# Altium schematic sheet STM32G4.SchDoc
size B; SheetNumber: 2; SheetTotal: 5
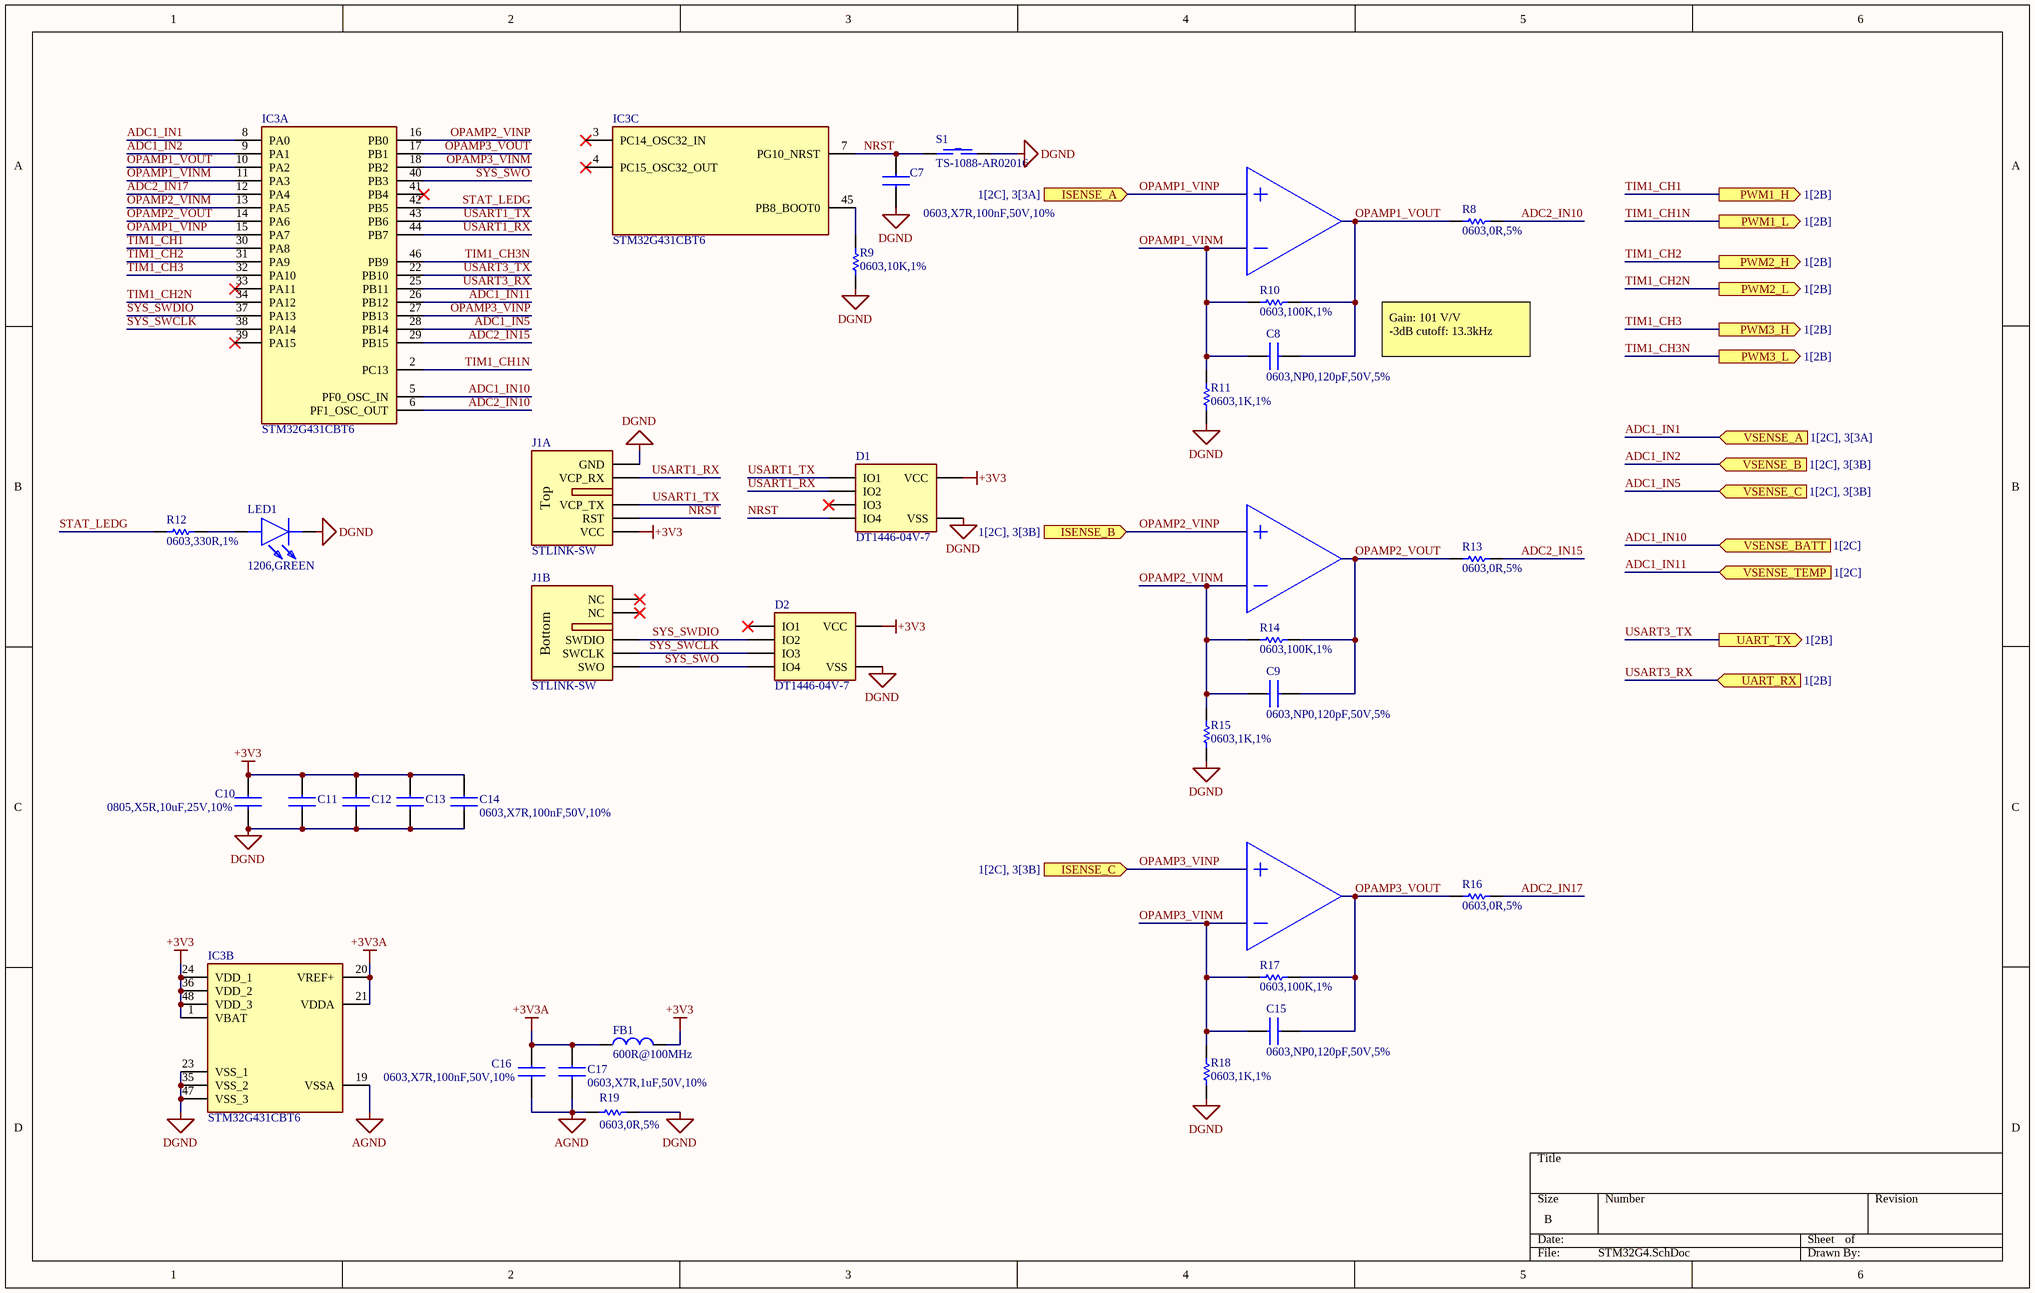
[diagram p0: STM32G4.SchDoc]

## Parts
C7  0603,X7R,100nF,50V,10%  [CAPC1608X90N]
C8  0603,NP0,120pF,50V,5%  [CAPC1608X90N]
C9  0603,NP0,120pF,50V,5%  [CAPC1608X90N]
C10  0805,X5R,10uF,25V,10%  [CAPC2012X145N]
C11  0603,X7R,100nF,50V,10%  [CAPC1608X90N]  (value not drawn)
C12  0603,X7R,100nF,50V,10%  [CAPC1608X90N]  (value not drawn)
C13  0603,X7R,100nF,50V,10%  [CAPC1608X90N]  (value not drawn)
C14  0603,X7R,100nF,50V,10%  [CAPC1608X90N]
C15  0603,NP0,120pF,50V,5%  [CAPC1608X90N]
C16  0603,X7R,100nF,50V,10%  [CAPC1608X90N]
C17  0603,X7R,1uF,50V,10%  [CAPC1608X90N]
D1  DT1446-04V-7  [SOTFL50P162X60-6N]
D2  DT1446-04V-7  [SOTFL50P162X60-6N]
FB1  600R@100MHz  [L0603]
IC3  STM32G431CBT6  [QFP50P900X900X160-48N]  (parts A,B,C of 3)
J1  STLINK-SW  [009159010061911]  (parts A,B of 2)  (no BOM)
LED1  1206,GREEN  [LEDC3216X120N]
R8  0603,0R,5%  [RESC1608X55N]
R9  0603,10K,1%  [RESC1608X55N]
R10  0603,100K,1%  [RESC1608X55N]
R11  0603,1K,1%  [RESC1608X55N]
R12  0603,330R,1%  [RESC1608X55N]
R13  0603,0R,5%  [RESC1608X55N]
R14  0603,100K,1%  [RESC1608X55N]
R15  0603,1K,1%  [RESC1608X55N]
R16  0603,0R,5%  [RESC1608X55N]
R17  0603,100K,1%  [RESC1608X55N]
R18  0603,1K,1%  [RESC1608X55N]
R19  0603,0R,5%  [RESC1608X55N]
S1  TS-1088-AR02016  [SW-SMD_L3.9-W3.0-P4.45]

## Ports
ISENSE_A (in, see 1[2C], 3[3A]), ISENSE_B (in, see 1[2C], 3[3B]), ISENSE_C (in, see 1[2C], 3[3B]), PWM1_H (out, see 1[2B]), PWM1_L (out, see 1[2B]), PWM2_H (out, see 1[2B]), PWM2_L (out, see 1[2B]), PWM3_H (out, see 1[2B]), PWM3_L (out, see 1[2B]), UART_RX (in, see 1[2B]), UART_TX (out, see 1[2B]), VSENSE_A (in, see 1[2C], 3[3A]), VSENSE_B (in, see 1[2C], 3[3B]), VSENSE_BATT (in, see 1[2C]), VSENSE_C (in, see 1[2C], 3[3B]), VSENSE_TEMP (in, see 1[2C])

## Nets
+3V3: C10.2 C11.2 C12.2 C13.2 C14.2 D1.5(VCC) D2.5(VCC) FB1.2 IC3.1(VBAT) IC3.24(VDD_1) IC3.36(VDD_2) IC3.48(VDD_3) J1.5(VCC)
+3V3A: C16.2 C17.2 FB1.1 IC3.20(VREF+) IC3.21(VDDA)
AGND: C16.1 C17.1 IC3.19(VSSA) R19.1
DGND: C7.1 C10.1 C11.1 C12.1 C13.1 C14.1 D1.2(VSS) D2.2(VSS) IC3.23(VSS_1) IC3.35(VSS_2) IC3.47(VSS_3) J1.1(GND) LED1.1(K) R9.1 R11.1 R15.1 R18.1 R19.2 S1.1
ADC1_IN1: IC3.8(PA0) ; port VSENSE_A
ADC1_IN2: IC3.9(PA1) ; port VSENSE_B
ADC1_IN5: IC3.28(PB14) ; port VSENSE_C
ADC1_IN10: IC3.5(PF0_OSC_IN) ; port VSENSE_BATT
ADC1_IN11: IC3.26(PB12) ; port VSENSE_TEMP
ADC2_IN10: IC3.6(PF1_OSC_OUT) R8.2
ADC2_IN15: IC3.29(PB15) R13.2
ADC2_IN17: IC3.12(PA4) R16.2
NRST: C7.2 D1.6(IO4) IC3.7(PG10_NRST) J1.4(RST) S1.2
OPAMP1_VINM: C8.1 IC3.11(PA3) R10.1 R11.2
OPAMP1_VINP: IC3.15(PA7) ; port ISENSE_A
OPAMP1_VOUT: C8.2 IC3.10(PA2) R8.1 R10.2
OPAMP2_VINM: C9.1 IC3.13(PA5) R14.1 R15.2
OPAMP2_VINP: IC3.16(PB0) ; port ISENSE_B
OPAMP2_VOUT: C9.2 IC3.14(PA6) R13.1 R14.2
OPAMP3_VINM: C15.1 IC3.18(PB2) R17.1 R18.2
OPAMP3_VINP: IC3.27(PB13) ; port ISENSE_C
OPAMP3_VOUT: C15.2 IC3.17(PB1) R16.1 R17.2
STAT_LEDG: IC3.42(PB5) R12.1
SYS_SWCLK: D2.4(IO3) IC3.38(PA14) J1.9(SWCLK)
SYS_SWDIO: D2.3(IO2) IC3.37(PA13) J1.8(SWDIO)
SYS_SWO: D2.6(IO4) IC3.40(PB3) J1.10(SWO)
TIM1_CH1: IC3.30(PA8) ; port PWM1_H
TIM1_CH1N: IC3.2(PC13) ; port PWM1_L
TIM1_CH2: IC3.31(PA9) ; port PWM2_H
TIM1_CH2N: IC3.34(PA12) ; port PWM2_L
TIM1_CH3: IC3.32(PA10) ; port PWM3_H
TIM1_CH3N: IC3.46(PB9) ; port PWM3_L
USART1_RX: D1.3(IO2) IC3.44(PB7) J1.2(VCP_RX)
USART1_TX: D1.1(IO1) IC3.43(PB6) J1.3(VCP_TX)
USART3_RX: IC3.25(PB11) ; port UART_RX
USART3_TX: IC3.22(PB10) ; port UART_TX
NetIC3_45: IC3.45(PB8_BOOT0) R9.2
NetLED1_2: LED1.2(A) R12.2

Not connected (* = marked no-connect by the designer): D1 4(IO3)*; D2 1(IO1)*; IC3 3(PC14_OSC32_IN)* 4(PC15_OSC32_OUT)* 33(PA11)* 39(PA15)* 41(PB4)*; J1 6(NC)* 7(NC)*

## Notes on the sheet
- Gain: 101 V/V
  -3dB cutoff: 13.3kHz
- (in symbol STLINK-SW, part A) Top
- (in symbol STLINK-SW, part B) Bottom

## Library data of the parts
C7 C11-C14 C16 = CC0603KRX7R9BB104: 50V 100nF X7R ±10% 0603 Multilayer Ceramic Capacitors MLCC - SMD/SMT ROHS; Manufacturer_Name: YAGEO; Datasheet Link: https://componentsearchengine.com/Datasheets/2/CC0603KRX7R9BB104.pdf; Height: 0.9mm; Manufacturer_Part_Number: CC0603KRX7R9BB104; Mouser Part Number: 603-CC603KRX7R9BB104; Mouser Price/Stock: https://www.mouser.co.uk/ProductDetail/YAGEO/CC0603KRX7R9BB104?qs=vTakOoo5QyLvVCYM2ge8LQ%3D%3D; Arrow Part Number: CC0603KRX7R9BB104; Arrow Price/Stock: https://www.arrow.com/en/products/cc0603krx7r9bb104/yageo?utm_currency=USD&region=europe; LCSC Part #: C14663
C8 C9 C15 = CC0603JRNPO9BN121: 50V 120pF NP0 ±5% 0603 Multilayer Ceramic Capacitors MLCC - SMD/SMT ROHS; Manufacturer_Name: YAGEO; Datasheet Link: https://componentsearchengine.com/Datasheets/2/CC0603KRX7R9BB104.pdf; Height: 0.9mm; Manufacturer_Part_Number: CC0603JRNPO9BN121; Mouser Part Number: 603-CC603KRX7R9BB104; Mouser Price/Stock: https://www.mouser.co.uk/ProductDetail/YAGEO/CC0603KRX7R9BB104?qs=vTakOoo5QyLvVCYM2ge8LQ%3D%3D; Arrow Part Number: CC0603KRX7R9BB104; Arrow Price/Stock: https://www.arrow.com/en/products/cc0603krx7r9bb104/yageo?utm_currency=USD&region=europe; LCSC Part #: C107035
C10 = CC0805KKX5R8BB106: 10 µF ±10% 25V Ceramic Capacitor X5R 0805 (2012 Metric); Manufacturer_Name: YAGEO; Datasheet Link: https://www.yageo.com/upload/media/product/productsearch/datasheet/mlcc/UPY-GPHC_X5R_4V-to-50V_27.pdf; Height: 1.45mm; Manufacturer_Part_Number: CC0805KKX5R8BB106; Mouser Part Number: 603-CC805KKX5R8BB106; Mouser Price/Stock: https://www.mouser.co.uk/ProductDetail/YAGEO/CC0805KKX5R8BB106?qs=57cj7OiSijm89pM64t1AGQ%3D%3D; Arrow Part Number: CC0805KKX5R8BB106; Arrow Price/Stock: https://www.arrow.com/en/products/cc0805kkx5r8bb106/yageo?utm_currency=USD&region=nac; LCSC Part #: C89831
C17 = CC0603KRX7R9BB105: 50V 1uF X7R ±10% 0603 Multilayer Ceramic Capacitors MLCC - SMD/SMT ROHS; Manufacturer_Name: YAGEO; Datasheet Link: https://www.yageo.com/upload/media/product/app/datasheet/mlcc/upy-gphc_x7r_6_3v-to-250v.pdf; Height: 0.95mm; Manufacturer_Part_Number: CC0603KRX7R9BB105; Mouser Part Number: 603-CC603KRX7R9BB105; Mouser Price/Stock: https://www.mouser.co.uk/ProductDetail/YAGEO/CC0603KRX7R9BB105?qs=6wERJjOp3mmF17%252BYi8cgJQ%3D%3D; Arrow Part Number: CC0603KRX7R9BB105; Arrow Price/Stock: https://www.arrow.com/en/products/cc0603krx7r9bb105/yageo?utm_currency=USD&region=nac; LCSC Part #: C559769
D1 D2 = DT1446-04V-7: 8.5V Clamp 4.7A (8/20µs) Ipp Tvs Diode Surface Mount SOT-563; Manufacturer_Name: Diodes Incorporated; Datasheet Link: https://www.diodes.com//assets/Datasheets/DT1446-04V.pdf; Height: 0.6mm; Manufacturer_Part_Number: DT1446-04V-7; Mouser Part Number: 621-DT1446-04V-7; Mouser Price/Stock: https://www.mouser.co.uk/ProductDetail/Diodes-Incorporated/DT1446-04V-7?qs=5V6w%252Be2aIqaQkUd2yRdmdA%3D%3D; Arrow Part Number: DT1446-04V-7; Arrow Price/Stock: https://www.arrow.com/en/products/dt1446-04v-7/diodes-incorporated; Manu Part #: DT1446-04V-7; LCSC Part #: C460066
FB1 = BLM18AG601SN1D: 380mΩ ±25% 600Ω@100MHz 0603 Ferrite Beads ROHS; LCSC Part #: C19330
IC3 = STM32G431CBT6: Arm Cortex-M4 32-bit MCU+FPU, 170 MHz / 213 DMIPS, up to 128 KB Flash, 32 KB SRAM, rich analog, math accelerator; Manufacturer_Name: STMicroelectronics; Datasheet Link: https://www.st.com/resource/en/datasheet/stm32g431cb.pdf; Height: 1.6mm; Manufacturer_Part_Number: STM32G431CBT6; Mouser Part Number: 511-STM32G431CBT6; Mouser Price/Stock: https://www.mouser.co.uk/ProductDetail/STMicroelectronics/STM32G431CBT6?qs=T3oQrply3y8OocyGDXq5wg%3D%3D; Arrow Part Number: STM32G431CBT6; Arrow Price/Stock: https://www.arrow.com/en/products/stm32g431cbt6/stmicroelectronics?utm_currency=USD&region=nac; LCSC Part #: C529355
J1 = STLINK-SW: SSL Connector 10 Position Adapter, Bridge Board to Board - Card Edge 0.079" (2.00mm)
LED1 = LTST-C150KGKT: 20mA 44.5mcd Water Clear -55℃~+85℃ 571nm Yellow Green 130° 75mW 2V 1206 LED Indication - Discrete ROHS; Manufacturer_Name: Lite-On; Datasheet Link: http://optoelectronics.liteon.com/upload/download/ds22-2000-072/ltst-c150kgkt.pdf; Height: 1.2mm; Manufacturer_Part_Number: LTST-C150KGKT; Mouser Part Number: 859-LTST-C150KGKT; Mouser Price/Stock: https://www.mouser.co.uk/ProductDetail/Lite-On/LTST-C150KGKT?qs=G7lFeYdtIHB%2FzaFKBwEyXw%3D%3D; Arrow Part Number: LTST-C150KGKT; Arrow Price/Stock: https://www.arrow.com/en/products/ltst-c150kgkt/lite-on-technology?utm_currency=USD&region=nac; LCSC Part #: C125085; Manu Part #: LTST-C150KGKT
R8 R13 R16 R19 = RC0603JR-070RL: 100mW Thick Film Resistor 75V ±5% 0Ω 0603 Chip Resistor - Surface Mount ROHS; Manufacturer_Name: YAGEO; Datasheet Link: https://www.mouser.com/catalog/specsheets/YAGEO_PYu_RC_Group_51_RoHS_L_12.pdf; Height: 0.55mm; Manufacturer_Part_Number: RC0603JR-070RL; LCSC Part #: C95177
R9 = RC0603FR-0710KL: 100mW 10kΩ 75V ±100ppm/℃ Thick Film Resistor ±1% 0603 Chip Resistor - Surface Mount RoHS; Manufacturer_Name: YAGEO; Datasheet Link: https://www.mouser.com/catalog/specsheets/YAGEO_PYu_RC_Group_51_RoHS_L_12.pdf; Height: 0.55mm; Manufacturer_Part_Number: RC0603FR-0710KL; LCSC Part #: C98220
R10 R14 R17 = RC0603FR-07100KL: 100mW Thick Film Resistor 75V ±100ppm/℃ ±1% 100kΩ 0603 Chip Resistor - Surface Mount ROHS; Manufacturer_Name: YAGEO; Datasheet Link: https://www.mouser.com/catalog/specsheets/YAGEO_PYu_RC_Group_51_RoHS_L_12.pdf; Height: 0.55mm; Manufacturer_Part_Number: RC0603FR-07100KL; LCSC Part #: C14675
R11 R15 R18 = RC0603FR-071KL: 100mW Thick Film Resistor 75V ±100ppm/℃ ±1% 1kΩ 0603 Chip Resistor - Surface Mount ROHS; Manufacturer_Name: YAGEO; Datasheet Link: https://www.mouser.com/catalog/specsheets/YAGEO_PYu_RC_Group_51_RoHS_L_12.pdf; Height: 0.55mm; Manufacturer_Part_Number: RC0603FR-071KL; LCSC Part #: C22548
R12 = RC0603FR-07330RL: 100mW 330Ω 75V ±100ppm/℃ Thick Film Resistor ±1% 0603 Chip Resistor - Surface Mount RoHS; Manufacturer_Name: YAGEO; Datasheet Link: https://www.mouser.com/catalog/specsheets/YAGEO_PYu_RC_Group_51_RoHS_L_12.pdf; Height: 0.55mm; Manufacturer_Part_Number: RC0603FR-07330RL; LCSC Part #: C105881; Manu Part #: RC0603FR-07330RL
S1 = TS-1088-AR02016: Without Bracket 50mA 4mm 100,000 Cycles 12V 1.6N 3mm 2mm Round Button Surface Mount,Vertical SPST SMD Tactile Switches ROHS; LCSC Part #: C720477; Manu Part #: TS-1088-AR02016